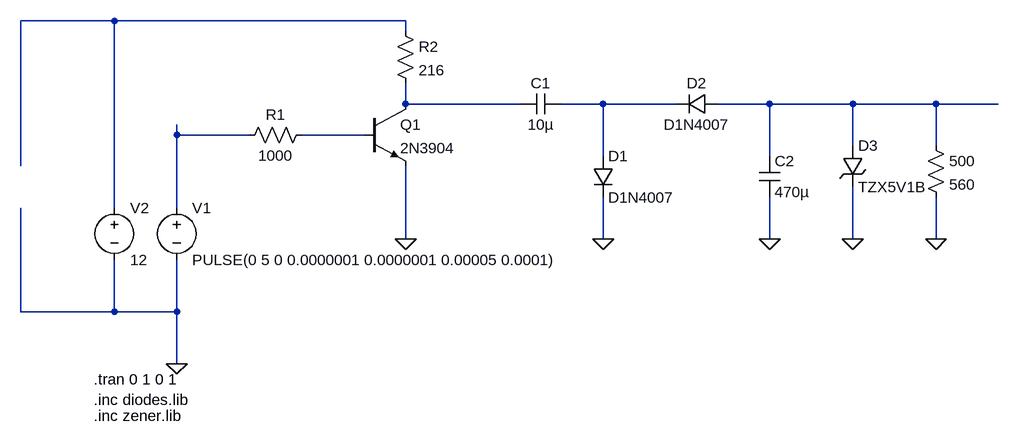
[diagram p0: schematic Draft2.asc]
Draft2.asc, the LTspice schematic file:
Version 4
SHEET 1 1304 680
WIRE -128 -160 -272 -160
WIRE 320 -160 -128 -160
WIRE 320 -144 320 -160
WIRE 320 -32 320 -64
WIRE 496 -32 320 -32
WIRE 624 -32 560 -32
WIRE 736 -32 624 -32
WIRE 880 -32 800 -32
WIRE 1008 -32 880 -32
WIRE 1136 -32 1008 -32
WIRE 1232 -32 1136 -32
WIRE -32 16 -32 0
WIRE 80 16 -32 16
WIRE 256 16 160 16
WIRE 1008 32 1008 -32
WIRE 1136 32 1136 -32
WIRE 624 48 624 -32
WIRE 880 48 880 -32
WIRE -272 64 -272 -160
WIRE -128 128 -128 -160
WIRE -32 128 -32 16
WIRE 320 176 320 64
WIRE 624 176 624 112
WIRE 880 176 880 112
WIRE 1008 176 1008 96
WIRE 1136 176 1136 112
WIRE -272 288 -272 128
WIRE -128 288 -128 208
WIRE -128 288 -272 288
WIRE -32 288 -32 208
WIRE -32 288 -128 288
WIRE -32 368 -32 288
FLAG -32 368 0
FLAG 320 176 0
FLAG 880 176 0
FLAG 1008 176 0
FLAG 1136 176 0
FLAG 624 176 0
SYMBOL voltage -32 112 R0
WINDOW 123 0 0 Left 2
WINDOW 39 0 0 Left 2
SYMATTR InstName V1
SYMATTR Value PULSE(0 5 0 0.0000001 0.0000001 0.00005 0.0001)
SYMBOL voltage -128 112 R0
WINDOW 123 0 0 Left 2
WINDOW 39 0 0 Left 2
SYMATTR InstName V2
SYMATTR Value 12
SYMBOL npn 256 -32 R0
SYMATTR InstName Q1
SYMATTR Value 2N3904
SYMBOL res 64 32 R270
WINDOW 0 32 56 VTop 2
WINDOW 3 0 56 VBottom 2
SYMATTR InstName R1
SYMATTR Value 1000
SYMBOL cap 496 -16 R270
WINDOW 0 32 32 VTop 2
WINDOW 3 0 32 VBottom 2
SYMATTR InstName C1
SYMATTR Value 10µ
SYMBOL diode 608 48 R0
SYMATTR InstName D1
SYMATTR Value D1N4007
SYMBOL diode 800 -48 R90
WINDOW 0 0 32 VBottom 2
WINDOW 3 32 32 VTop 2
SYMATTR InstName D2
SYMATTR Value D1N4007
SYMBOL cap 864 48 R0
SYMATTR InstName C2
SYMATTR Value 470µ
SYMBOL zener 992 32 R0
SYMATTR InstName D3
SYMATTR Value TZX5V1B
SYMBOL res 1120 16 R0
SYMATTR InstName 500
SYMATTR Value 560
SYMBOL res 304 -160 R0
SYMATTR InstName R2
SYMATTR Value 216
TEXT -160 392 Left 2 !.tran 0 1 0 1
TEXT -160 424 Left 2 !.inc diodes.lib
TEXT -160 448 Left 2 !.inc zener.lib

The netlist it stands for:
* Draft2.asc
V1 N005 0 PULSE(0 5 0 0.0000001 0.0000001 0.00005 0.0001)
V2 N001 0 12
Q1 N002 N006 0 0 2N3904
R1 N005 N006 1000
C1 N002 N003 10µ
D1 N003 0 D1N4007
D2 N004 N003 D1N4007
C2 N004 0 470µ
D3 N004 0 TZX5V1B
R§500 N004 0 560
R2 N001 N002 216
.model D D
.lib standard.dio
.model NPN NPN
.model PNP PNP
.lib standard.bjt
.tran 0 1 0 1
.inc diodes.lib
.inc zener.lib
.backanno
.end